# Altium project LED_CONTROLLER.PrjPCB
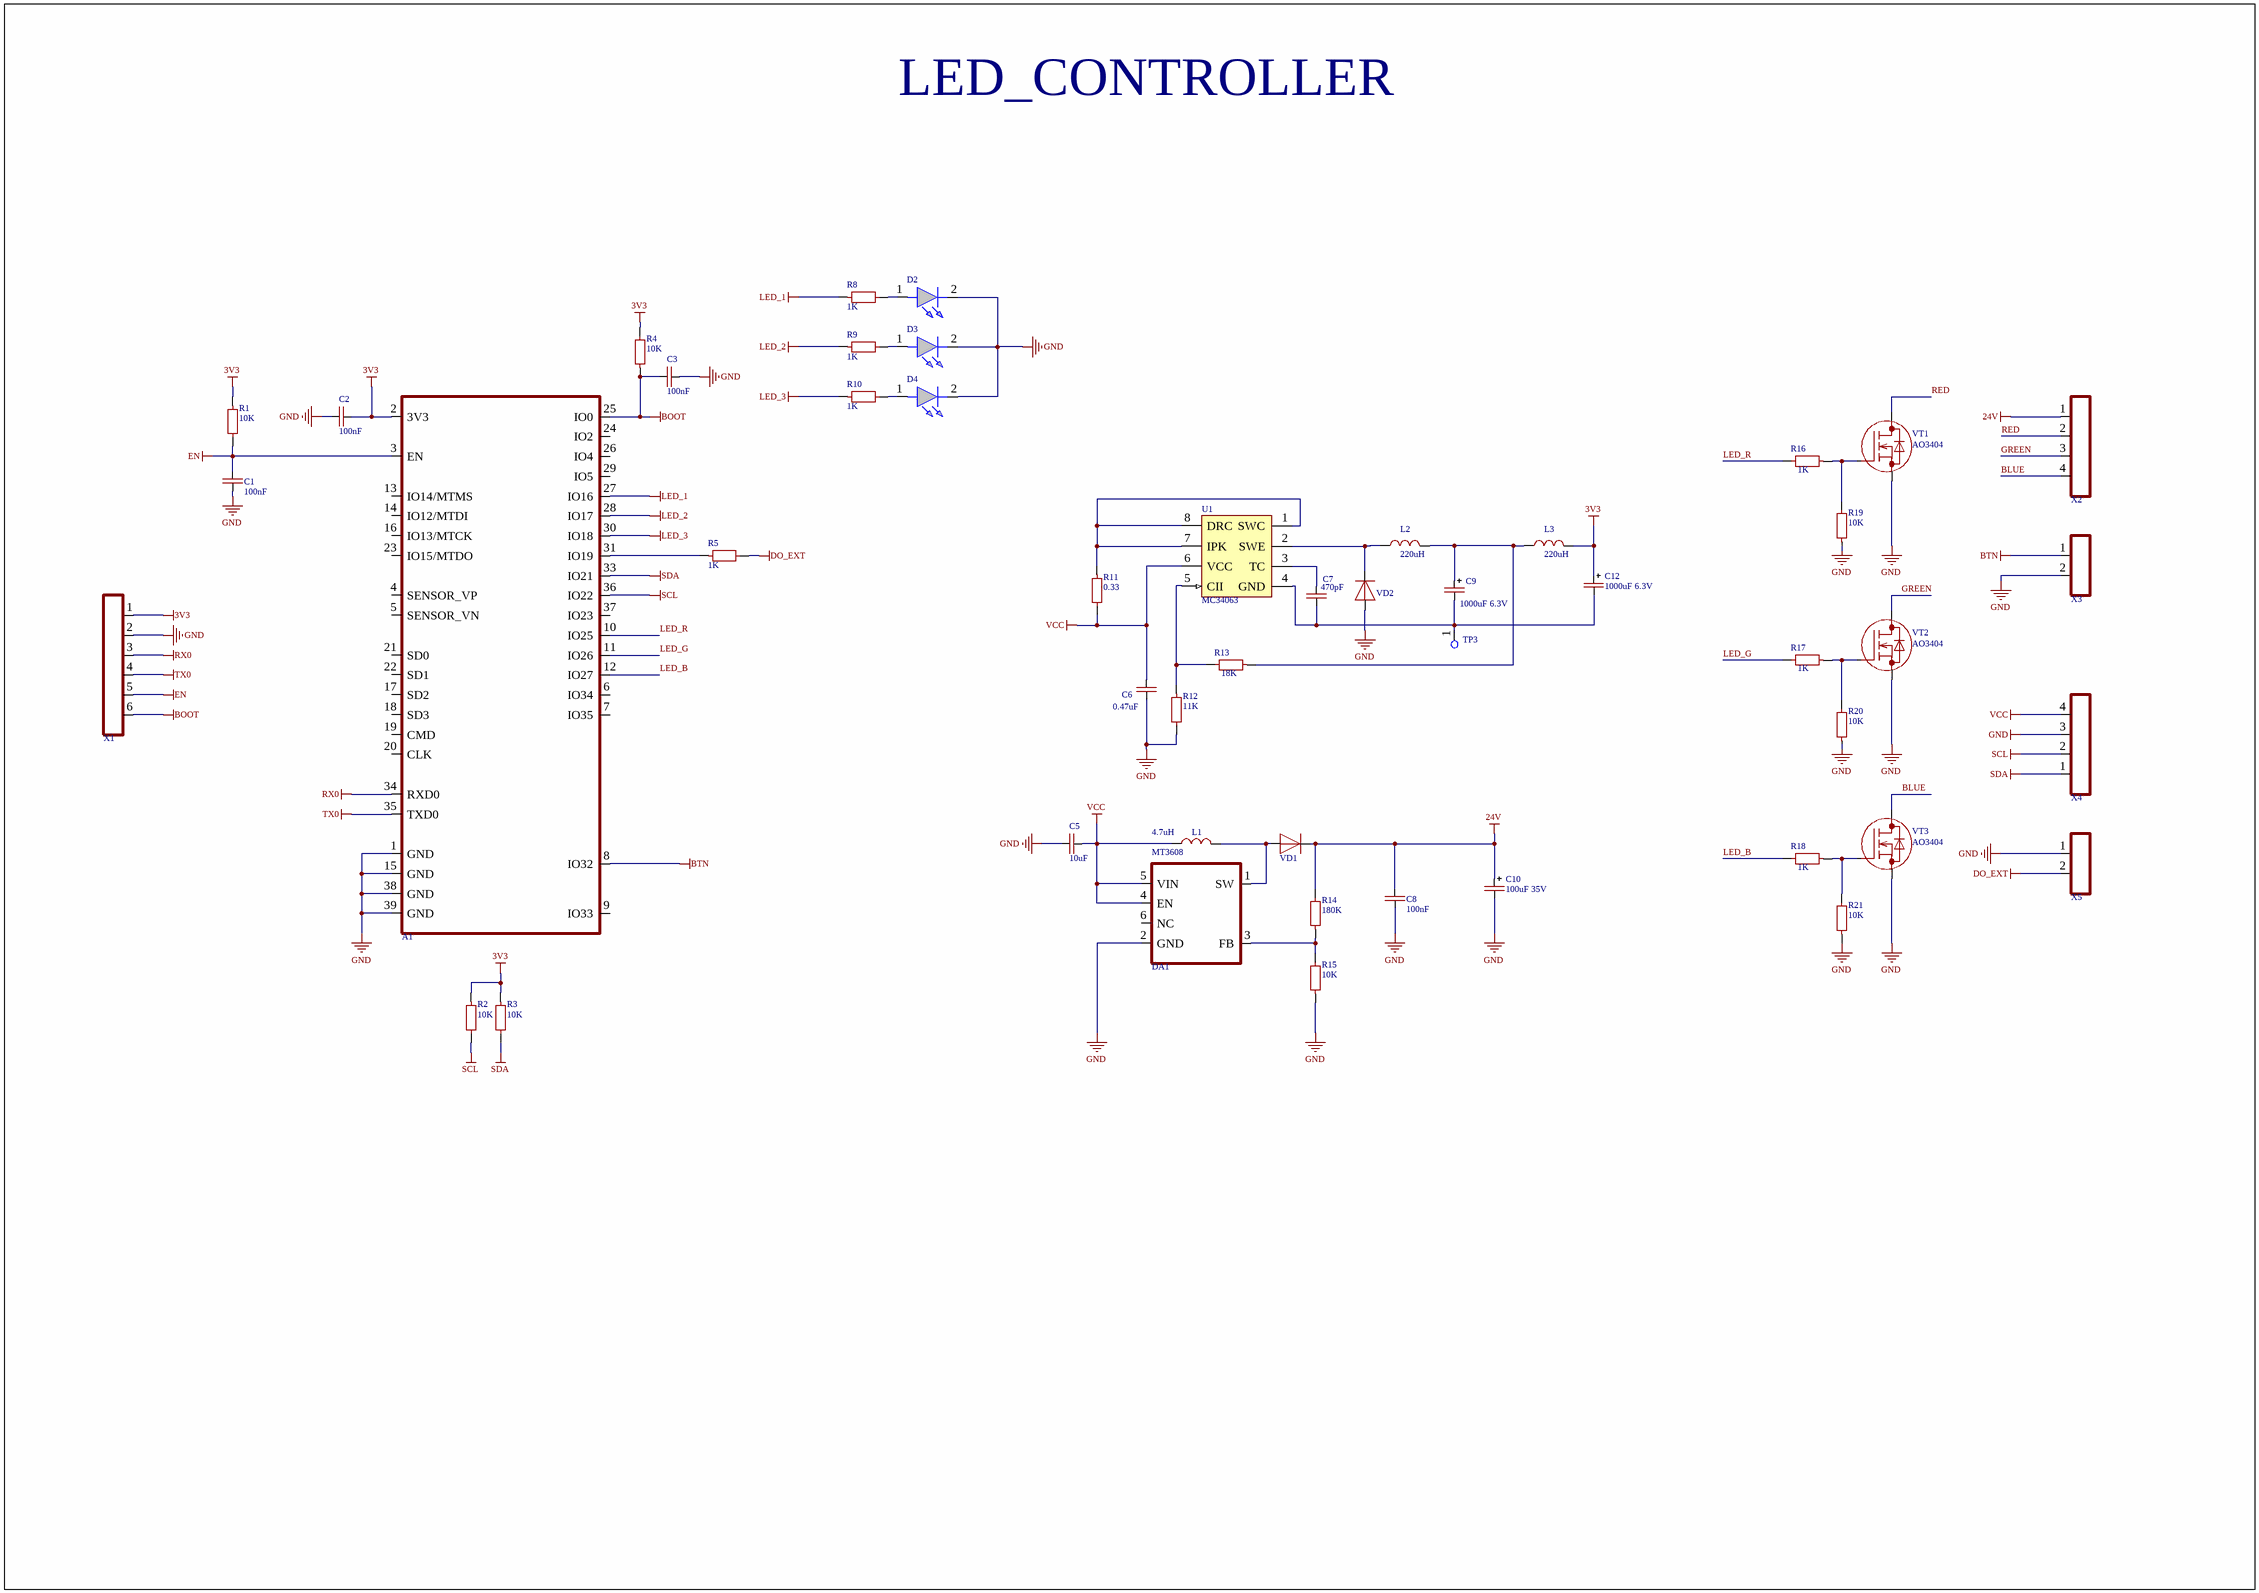
[diagram p0: LED_CONTROLLER.SchDoc]
1 sheet, 49 parts. Net scope: global (net labels, ports and power ports of the same name join across sheets).
Board file: LED_CONTROLLER.PcbDoc

## Sheet LED_CONTROLLER.SchDoc
size A2; SPICEModelCacheYQEDCYZF: <root> / <DocumentId>YQEDCYZF</DocumentId> / </root>

### Parts
A1  MOD-ESP32-WROOM-32E  [MOD-ESP32-WROOM-32E]  (value not drawn)
C1  100nF  [CAP-0805]
C2  100nF  [CAP-0805]
C3  100nF  [CAP-0805]
C5  10uF  [CAP-1206]
C6  0.47uF  [CAP-0805]
C7  470pF  [CAP-0805]
C8  100nF  [CAP-0805]
C9  1000uF 6.3V  [CAPPOL_SMD_SIZE_E]
C10  100uF 35V  [CAPPOL_SMD_SIZE_E]
C12  1000uF 6.3V  [CAPPOL_SMD_SIZE_E]
D2  151031YS06000  [LED_BLUE]  (value not drawn)
D3  151031YS06000  [LED_BLUE]  (value not drawn)
D4  151031YS06000  [LED_BLUE]  (value not drawn)
DA1  MT3608  [SOT23-6]
L1  4.7uH  [IND-7850]
L2  220uH  [IND-7850]
L3  220uH  [IND-7850]
R1  10K  [RES-0805]
R2  10K  [RES-0805]
R3  10K  [RES-0805]
R4  10K  [RES-0805]
R5  1K  [RES-0805]
R8  1K  [RES-0805]
R9  1K  [RES-0805]
R10  1K  [RES-0805]
R11  0.33  [RES-2512]
R12  11K  [RES-0805]
R13  18K  [RES-0805]
R14  180K  [RES-0805]
R15  10K  [RES-0805]
R16  1K  [RES-0805]
R17  1K  [RES-0805]
R18  1K  [RES-0805]
R19  10K  [RES-0805]
R20  10K  [RES-0805]
R21  10K  [RES-0805]
TP3  Test_Point_PCB  [Pin_Test_Point(Orange)]  (value not drawn)
U1  MC34063  [SOIC-8_M]
VD1  DIODE  [DO-214AC, SMA]  (value not drawn)
VD2  DIODE  [DO-214AC, SMA]  (value not drawn)
VT1  AO3404  [SOT23-3]
VT2  AO3404  [SOT23-3]
VT3  AO3404  [SOT23-3]
X1  CONN-6-PIN  [CONN-PLS-6-2.00mm]  (value not drawn)
X2  CONN-4-PIN  [CONN-PLS-4-2.54mm]  (value not drawn)
X3  CONN-2-PIN  [XH2]  (value not drawn)
X4  CONN-4-PIN  [CONN-PLS-4-2.54mm]  (value not drawn)
X5  CONN-2-PIN  [XH2]  (value not drawn)

### Nets
3V3: A1.2(3V3) C2.1 C12.1(+) L3.2 R1.1 R2.1 R3.1 R4.2 X1.1
24V: C8.1 C10.1(+) R14.2 VD1.1(C) X2.1
BOOT: A1.25(IO0) C3.2 R4.1 X1.6
BTN: A1.8(IO32) X3.1
DO_EXT: R5.2 X5.2
EN: A1.3(EN) C1.1 R1.2 X1.5
GND: A1.1(GND) A1.15(GND) A1.38(GND) A1.39(GND) C1.2 C2.2 C3.1 C5.2 C6.2 C8.2 C10.2(-) D2.2(K) D3.2(K) D4.2(K) DA1.2(GND) R12.2 R15.1 R19.1 R20.1 R21.1 VD2.2(A) VT1.2(S) VT2.2(S) VT3.2(S) X1.2 X3.2 X4.3 X5.1
LED_1: A1.27(IO16) R8.1
LED_2: A1.28(IO17) R9.1
LED_3: A1.30(IO18) R10.1
RX0: A1.34(RXD0) X1.3
SCL: A1.36(IO22) R2.2 X4.2
SDA: A1.33(IO21) R3.2 X4.1
TX0: A1.35(TXD0) X1.4
VCC: C5.1 C6.1 DA1.4(EN) DA1.5(VIN) L1.1 R11.2 U1.6(VCC) X4.4
BLUE: VT3.3(D) X2.4
GREEN: VT2.3(D) X2.3
LED_B: A1.12(IO27) R18.2
LED_G: A1.11(IO26) R17.2
LED_R: A1.10(IO25) R16.2
RED: VT1.3(D) X2.2
NetA1_31: A1.31(IO19) R5.1
NetC7_1: C7.1 U1.3(TC)
NetC7_2: C7.2 C9.2(-) C12.2(-) TP3.1(G9) U1.4(GND)
NetC9_1: C9.1(+) L2.2 L3.1 R13.1
NetD2_1: D2.1(A) R8.2
NetD3_1: D3.1(A) R9.2
NetD4_1: D4.1(A) R10.2
NetDA1_1: DA1.1(SW) L1.2 VD1.2(A)
NetDA1_3: DA1.3(FB) R14.1 R15.2
NetL2_1: L2.1 U1.2(SWE) VD2.1(C)
NetR11_1: R11.1 U1.1(SWC) U1.7(IPK) U1.8(DRC)
NetR12_1: R12.1 R13.2 U1.5(CII)
NetR16_1: R16.1 R19.2 VT1.1(G)
NetR17_1: R17.1 R20.2 VT2.1(G)
NetR18_1: R18.1 R21.2 VT3.1(G)

Not connected (* = marked no-connect by the designer): A1 4(SENSOR_VP) 5(SENSOR_VN) 6(IO34) 7(IO35) 9(IO33) 13(IO14/MTMS) 14(IO12/MTDI) 16(IO13/MTCK) 17(SD2) 18(SD3) 19(CMD) 20(CLK) 21(SD0) 22(SD1) 23(IO15/MTDO) 24(IO2) 26(IO4) 29(IO5) 37(IO23); DA1 6(NC)

### Notes on the sheet
- LED_CONTROLLER

### Library data of the parts
C1-C3 C5-C8 = CAP-NON-POLAR
C9 C10 C12 = CAP-POLAR
D2-D4 = LED: WURTH ELEKTRONIK - 151031YS06000 - LED, Yellow, Through Hole, T-1 (3mm), 30 mA, 2 V, 590 nm; Geometry.Height: 5.5mm; Manufacturer_Name: Wurth Elektronik; Manufacturer_Part_Number: 151031YS06000; Mouser Part Number: 710-151031YS06000; Mouser Price/Stock: https://www.mouser.co.uk/ProductDetail/Wurth-Elektronik/151031YS06000?qs=LlUlMxKIyB3xSYYW%252BcuBiQ%3D%3D; Arrow Part Number: *; Arrow Price/Stock: *; Mouser Testing Part Number: *; Mouser Testing Price/Stock: *; Datasheet Link: https://katalog.we-online.de/led/datasheet/151031YS06000.pdf
L1-L3 = IND-CONST
R1-R5 R8-R21 = RES-CONST
TP3 = TP_PCB?: Test_Point
VT1-VT3 = MOSFET-N-GDS